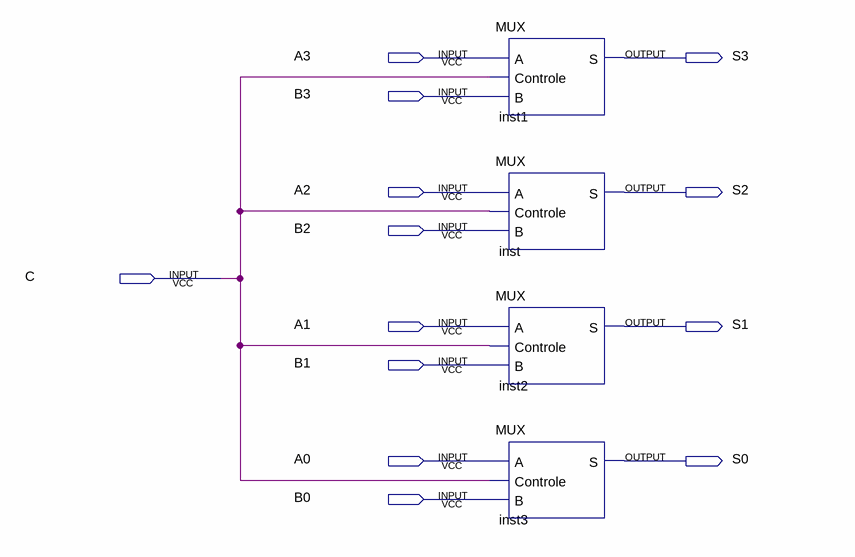
[diagram p0: schematic sheet]
// Quartus schematic MUX4BIT.bdf as structural Verilog: 4 symbols, 13 pins
module MUX4BIT (
  input  A3,
  input  B3,
  input  A2,
  input  B2,
  input  C,
  input  A1,
  input  B1,
  input  A0,
  input  B0,
  output S3,
  output S2,
  output S1,
  output S0
);

  MUX inst1 (.A(A3), .Controle(C), .B(B3), .S(S3));
  MUX inst (.A(A2), .Controle(C), .B(B2), .S(S2));
  MUX inst2 (.A(A1), .Controle(C), .B(B1), .S(S1));
  MUX inst3 (.A(A0), .Controle(C), .B(B0), .S(S0));
endmodule
